# EAGLE design pico (EAGLE 6.4)
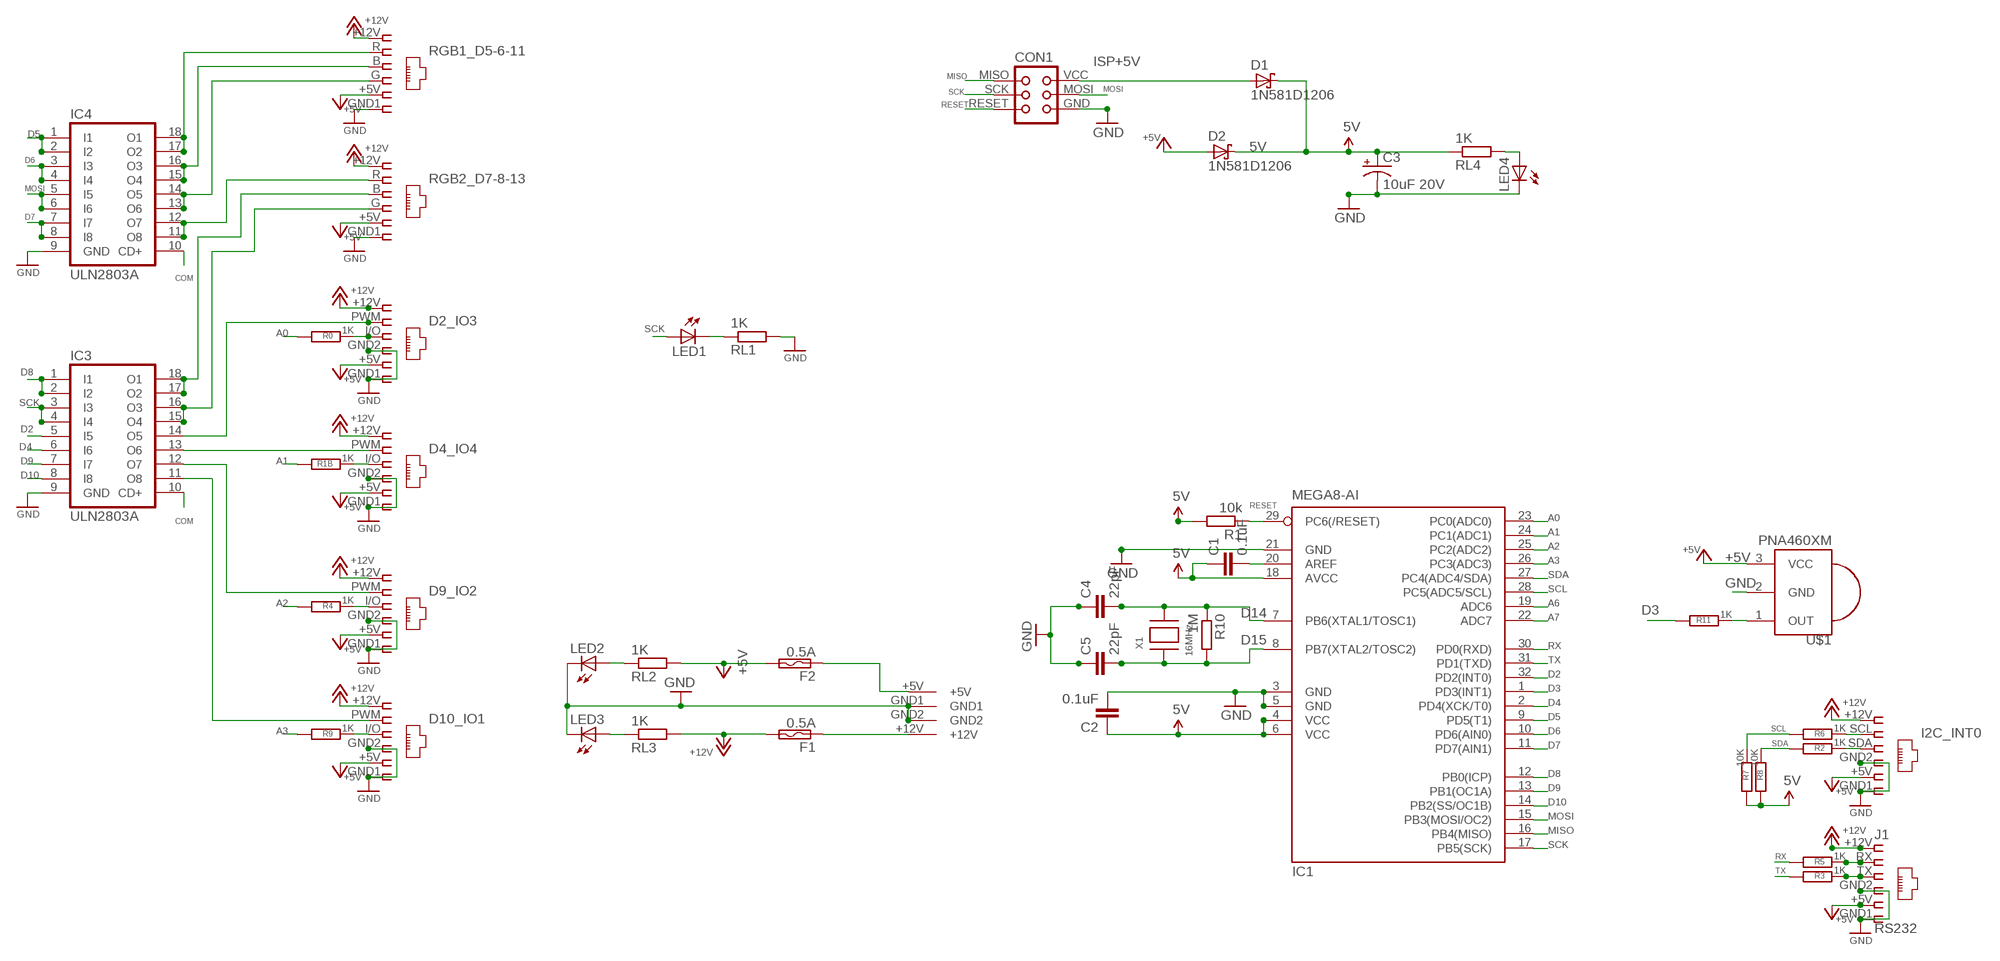
[diagram p0: schematic, sheet 1]

## Parts
C1  0.1uF  C-EUC1206  [C1206]
C2  0.1uF  C-EUC1206  [C1206]
C3  10uF 20V  CAP_POL1206-KIT  [EIA3216-KIT]
C4  22pF  C-EUC1206  [C1206]
C5  22pF  C-EUC1206  [C1206]
CON1  TINYISP  [TINYISP]
D1  1N581D1206  [LED-1206]
D2  1N581D1206  [LED-1206]
D2_IO3  IO3  RJ12STRAIGHT  [RJ12-STRAIGHT]
D4_IO4  IO4  RJ12STRAIGHT  [RJ12-STRAIGHT]
D9_IO2  IO2  RJ12STRAIGHT  [RJ12-STRAIGHT]
D10_IO1  IO1  RJ12STRAIGHT  [RJ12-STRAIGHT]
F1  0.5A  POLYSWITCHSMD1812  [C1812]
F2  0.5A  POLYSWITCHSMD1812  [C1812]
I2C_INT0  I2C  RJ12STRAIGHT-I2C  [RJ12-STRAIGHT-I2C]
IC1  MEGA8-AI  [TQFP32-08]
IC3  ULN2803A  [SO18W]
IC4  ULN2803A  [SO18W]
J1  RS232  RJ12STRAIGHT-RS232-SERVER  [RJ12-STRAIGHT-RS232]
LED1  LED3MM  [LED3MM]
LED2  LED3MM  [LED3MM]
LED3  LED3MM  [LED3MM]
LED4  LED3MM  [LED3MM]
R0  1K  R-EU_M1206  [M1206]
R1  10k  R-EU_M1206  [M1206]
R1B  1K  R-EU_M1206  [M1206]
R2  1K  R-EU_M1206  [M1206]
R3  1K  R-EU_M1206  [M1206]
R4  1K  R-EU_M1206  [M1206]
R5  1K  R-EU_M1206  [M1206]
R6  1K  R-EU_M1206  [M1206]
R7  10K  R-EU_M1206  [M1206]
R8  10K  R-EU_M1206  [M1206]
R9  1K  R-EU_M1206  [M1206]
R10  1M  R-EU_M1206  [M1206]
R11  1K  R-EU_M1206  [M1206]
RGB1_D5-6-11  RGB1  RJ12STRAIGHT-RGB  [RJ12-STRAIGHT-RGB]
RGB2_D7-8-13  RGB2  RJ12STRAIGHT-RGB  [RJ12-STRAIGHT-RGB]
RL1  1K  R-EU_M1206  [M1206]
RL2  1K  R-EU_M1206  [M1206]
RL3  1K  R-EU_M1206  [M1206]
RL4  1K  R-EU_M1206  [M1206]
U$1  PNA460XM  [PNA460XM]
U$2  KPJX-4S-S  [KPJX-4S-S]
X1  16MHz  XTALNX6035  [NX6035]

## Nets
5V [power]: C1.1 C2.1 C3.A(+) D1.C D2.C IC1.4(VCC) IC1.6(VCC) IC1.18(AVCC) R1.2 R7.2 R8.2 RL4.1
+5V: D2.A D2_IO3.+5V D4_IO4.+5V D9_IO2.+5V D10_IO1.+5V F2.2 I2C_INT0.+5V J1.+5V RGB1_D5-6-11.+5V RGB2_D7-8-13.+5V RL2.2 U$1.3(VCC)
+12V [highpower]: D2_IO3.+12V D4_IO4.+12V D9_IO2.+12V D10_IO1.+12V F1.2 I2C_INT0.+12V J1.+12V RGB1_D5-6-11.+12V RGB2_D7-8-13.+12V RL3.2
A0: IC1.23(PC0(ADC0)) R0.2
A1 [fine]: IC1.24(PC1(ADC1)) R1B.2
A2 [fine]: IC1.25(PC2(ADC2)) R4.2
A3 [fine]: IC1.26(PC3(ADC3)) R9.2
A6: IC1.19(ADC6)
A7: IC1.22(ADC7)
COM: IC3.10(CD+) IC4.10(CD+)
D2: IC1.32(PD2(INT0)) IC3.5(I5)
D2B: D9_IO2.I/O R4.1
D2B1: D10_IO1.I/O R9.1
D2B4: I2C_INT0.SDA R2.1
D2B5: J1.TX R3.1
D2B6: D2_IO3.I/O R0.1
D2B7: D4_IO4.I/O R1B.1
D3: IC1.1(PD3(INT1)) R11.2
D4: IC1.2(PD4(XCK/T0)) IC3.6(I6)
D5: IC1.9(PD5(T1)) IC4.1(I1) IC4.2(I2)
D6: IC1.10(PD6(AIN0)) IC4.3(I3) IC4.4(I4)
D7: IC1.11(PD7(AIN1)) IC4.7(I7) IC4.8(I8)
D8: IC1.12(PB0(ICP)) IC3.1(I1) IC3.2(I2)
D9: IC1.13(PB1(OC1A)) IC3.7(I7)
D10: IC1.14(PB2(SS/OC1B)) IC3.8(I8)
D14: C4.2 IC1.7(PB6(XTAL1/TOSC1)) R10.1 X1.P$2
D15: C5.2 IC1.8(PB7(XTAL2/TOSC2)) R10.2 X1.P$1
GND [power]: C2.2 C3.C(-) C4.1 C5.1 CON1.GND D2_IO3.GND1 D2_IO3.GND2 D4_IO4.GND1 D4_IO4.GND2 D9_IO2.GND1 D9_IO2.GND2 D10_IO1.GND1 D10_IO1.GND2 I2C_INT0.GND1 I2C_INT0.GND2 IC1.3(GND) IC1.5(GND) IC1.21(GND) IC3.9(GND) IC4.9(GND) J1.GND1 J1.GND2 LED2.K(C) LED3.K(C) LED4.K(C) RGB1_D5-6-11.GND1 RGB2_D7-8-13.GND1 RL1.2 U$1.2(GND) U$2.GND1 U$2.GND2
ISP+5V: CON1.VCC D1.A
MISO [fine]: CON1.MISO IC1.16(PB4(MISO))
MOSI [fine]: CON1.MOSI IC1.15(PB3(MOSI/OC2)) IC4.5(I5) IC4.6(I6)
N$1 [PWM]: IC4.13(O6) IC4.14(O5) RGB1_D5-6-11.G
N$2 [PWM]: D4_IO4.PWM IC3.13(O6)
N$3: LED1.K(C) RL1.1
N$4: C1.2 IC1.20(AREF)
N$5 [PWM]: IC4.11(O8) IC4.12(O7) RGB2_D7-8-13.R
N$6: F2.1 U$2.+5V
N$7: LED4.A RL4.2
N$8: F1.1 U$2.+12V
N$9: R11.1 U$1.1(OUT)
N$22 [PWM]: D9_IO2.PWM IC3.12(O7)
N$48 [PWM]: IC3.17(O2) IC3.18(O1) RGB2_D7-8-13.B
N$50 [PWM]: IC4.15(O4) IC4.16(O3) RGB1_D5-6-11.B
N$51 [PWM]: D10_IO1.PWM IC3.11(O8)
N$57 [PWM]: IC3.15(O4) IC3.16(O3) RGB2_D7-8-13.G
N$60 [PWM]: D2_IO3.PWM IC3.14(O5)
N$68 [PWM]: IC4.17(O2) IC4.18(O1) RGB1_D5-6-11.R
N$70: J1.RX R5.1
N$71: I2C_INT0.SCL R6.1
N$75: LED3.A RL3.1
N$76: LED2.A RL2.1
RESET [fine]: CON1.RESET IC1.29(PC6(/RESET)) R1.1
RX: IC1.30(PD0(RXD)) R5.2
SCK [fine]: CON1.SCK IC1.17(PB5(SCK)) IC3.3(I3) IC3.4(I4) LED1.A
SCL: IC1.28(PC5(ADC5/SCL)) R6.2 R7.1
SDA: IC1.27(PC4(ADC4/SDA)) R2.2 R8.1
TX: IC1.31(PD1(TXD)) R3.2

## Library data of the parts
C1 C2 C4 C5 = resistor:C-EU: CAPACITOR, European symbol
C3 = SparkFun:CAP_POL: Capacitor Polarized These are standard SMD and PTH capacitors. Normally 10uF, 47uF, and 100uF in electrolytic and tantalum varieties. Always verify the external diameter of the through hole cap, it varies with capacity, voltage, and manufacturer. The EIA devices should be standard.
CON1 = lpatiny:TINYISP: CONNECTOR; OC_FARNELL: unknown; OC_NEWARK: unknown
D1 D2 = lpatiny:1N581*: 1.0A SCHOTTKY BARRIER RECTIFIER Source: http://www.diodes.com/datasheets/ds23001.pdf
D2_IO3 D4_IO4 D9_IO2 D10_IO1 I2C_INT0 J1 RGB1_D5-6-11 RGB2_D7-8-13 = lpatiny:RJ12: CORCOM Modular RJ Jacks No Shield Source: www.tycoelectronics.com .. ENG_DS_1654001_1099_RJ_L_0507.pdf
F1 F2 = lpatiny:POLYSWITCH: PolySwitch (TM) Resettable Device Source: Data sheet <http://www.farnell.com/datasheets/13482.pdf>
IC1 = atmel:MEGA8: MICROCONTROLLER 8 Kbytes FLASH, 1 kbytes SRAM, 512 bytes EEPROM, USART, 6-channel 10 bit ADC, 2-channel 8 bit ADC Pin compatible with Atmega48, ATMega88, ATMega168 Source: avr.lbr; MPN: ATMEGA8-16AU; OC_FARNELL: 9171371; OC_NEWARK: 73M8863
IC3 IC4 = lpatiny:ULN2803A: DRIVER ARRAY
LED1-LED4 = lpatiny:LED3MM
R0 R1 R1B R2-R11 RL1-RL4 = resistor:R-EU_: RESISTOR, European symbol
U$1 = adafruit:PNA460XM: IR 38KHz receiver PNA4602 and related receivers http://www.ladyada.net/library/pcb/eaglelibrary.html
U$2 = lpatiny:KPJX-4S-S
X1 = lpatiny:XTAL: Low cost SMT crystals, no capacitors included http://www.ladyada.net/library/eagle

## Net classes
0 default: width 0.457 mm
1 power: width 0.457 mm
2 highpower: width 0.914 mm
3 fine: width 0.203 mm
4 PWM: width 0.61 mm

## Board
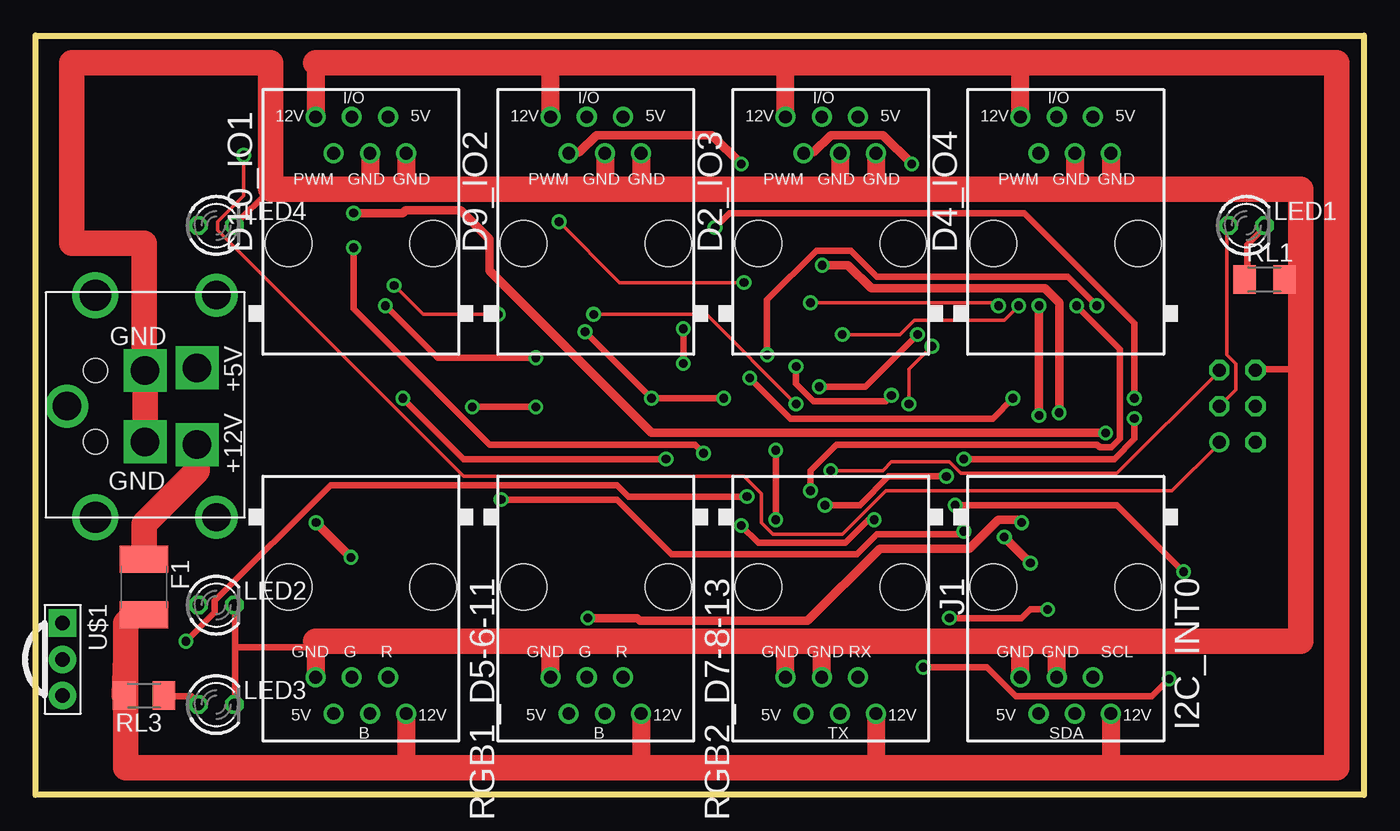
[diagram p1: board, top side]
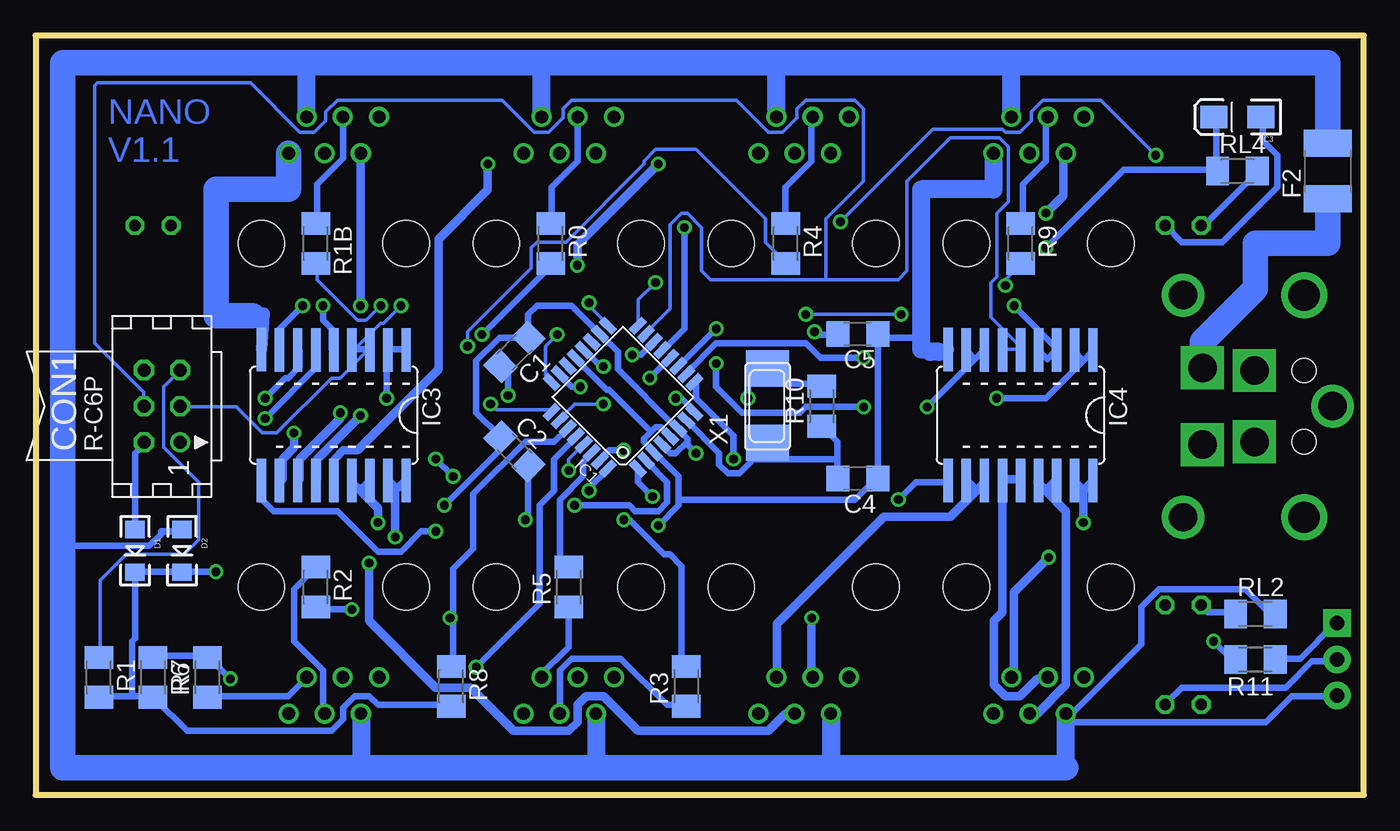
[diagram p2: board, bottom side, seen from below]

Size 93.34 x 53.34 mm. Coordinates in mm from the lower left corner, seen from the top.
Outline: 0,0 0,53.34 93.34,53.34 93.34,0 0,0
Copper layers (1*16): Top 0.035mm / dielectric 1.5mm / Bottom 0.035mm
Design rules "default *": minimum track width 10mil, minimum drill 24mil, track to track 8mil, track to pad 8mil, pad to pad 8mil, via to via 8mil, smd to smd 8mil, copper to edge 6mil, drill to drill 6mil, minimum pad ring 10mil, minimum via ring 8mil, stop-mask expansion 4mil, vias tented up to drill 0mil, thermal gap 10mil
vRestrict: area 17.8,19.7 to 30.5,24.8; area 17.8,28.6 to 30.5,33.7; area 66,28.6 to 78.7,33.7; area 66,19.7 to 78.7,24.8; area 44.4,26.6 to 53.4,35.6; area 50.8,20.3 to 59.7,29.3; area 50.8,26.6 to 59.7,35.6; area 44.4,20.3 to 53.4,29.3

### Footprints (pad centres in the part's own frame; a part is rotated, then mirrored left to right if it is on the bottom)
C1206 = smd 1.6 x 1.8: 1 -1.4,0; 2 1.4,0
EIA3216-KIT = smd 1.9 x 1.6: A 1.65,0; C -1.65,0
TINYISP = drill 0.914 octagon: GND 2.54,1.27; MOSI 0,1.27; RESET 2.54,-1.27; SCK 0,-1.27; VCC -2.54,1.27 | drill 0.914: MISO -2.54,-1.27
LED-1206 = smd 1.2 x 1.4: A -1.5,0; C 1.5,0
RJ12-STRAIGHT = drill 0.9 pad 1.4: +5V 1.905,8.89; +12V -3.175,8.89; GND1 3.175,6.35; GND2 0.635,6.35; I/O -0.635,8.89; PWM -1.905,6.35 | hole 3.251: -5.08,0; 5.08,0
C1812 = smd 1.9 x 3.4: 1 -1.95,0; 2 1.95,0
RJ12-STRAIGHT-I2C = drill 0.9 pad 1.4: +5V 1.905,8.89; +12V -3.175,8.89; GND1 3.175,6.35; GND2 0.635,6.35; SCL -1.905,6.35; SDA -0.635,8.89 | hole 3.251: -5.08,0; 5.08,0
TQFP32-08 = smd 1.27 x 0.559: 1 -4.293,2.8; 2 -4.293,2; 3 -4.293,1.2; 4 -4.293,0.4; 5 -4.293,-0.4; 6 -4.293,-1.2; 7 -4.293,-2; 8 -4.293,-2.8; 17 4.293,-2.8; 18 4.293,-2; 19 4.293,-1.2; 20 4.293,-0.4; 21 4.293,0.4; 22 4.293,1.2; 23 4.293,2; 24 4.293,2.8 | smd 0.559 x 1.27: 9 -2.8,-4.293; 10 -2,-4.293; 11 -1.2,-4.293; 12 -0.4,-4.293; 13 0.4,-4.293; 14 1.2,-4.293; 15 2,-4.293; 16 2.8,-4.293; 25 2.8,4.293; 26 2,4.293; 27 1.2,4.293; 28 0.4,4.293; 29 -0.4,4.293; 30 -1.2,4.293; 31 -2,4.293; 32 -2.8,4.293
SO18W = smd 0.66 x 3.048: 1 -5.08,-4.585; 2 -3.81,-4.585; 3 -2.54,-4.585; 4 -1.27,-4.585; 5 0,-4.585; 6 1.27,-4.585; 7 2.54,-4.585; 8 3.81,-4.585; 9 5.08,-4.623; 10 5.08,4.585; 11 3.81,4.585; 12 2.54,4.585; 13 1.27,4.585; 14 0,4.585; 15 -1.27,4.585; 16 -2.54,4.585; 17 -3.81,4.585; 18 -5.08,4.585
RJ12-STRAIGHT-RS232 = drill 0.9 pad 1.4: +5V 1.905,8.89; +12V -3.175,8.89; GND1 3.175,6.35; GND2 0.635,6.35; RX -1.905,6.35; TX -0.635,8.89 | hole 3.251: -5.08,0; 5.08,0
LED3MM = drill 0.813 octagon: A -1.27,0; K 1.27,0
M1206 = smd 1.6 x 2: 1 -1.4,0; 2 1.4,0
RJ12-STRAIGHT-RGB = drill 0.9 pad 1.4: +5V 1.905,8.89; +12V -3.175,8.89; B -0.635,8.89; G 0.635,6.35; GND1 3.175,6.35; R -1.905,6.35 | hole 3.251: -5.08,0; 5.08,0
PNA460XM = drill 1.016 pad 1.93 square: 1 -2.54,0 | drill 1.016 pad 1.93: 2 0,0; 3 2.54,0
KPJX-4S-S = drill 2 square: +5V 2.7,1.35; +12V -2.7,1.35; GND1 -2.5,5; GND2 2.5,5 | drill 2: P$1 -7.8,0; P$2 7.8,0; P$11 0,10.5 | drill 2.2: P$3 -7.8,8.5; P$4 7.8,8.5 | hole 1.7: -2.5,8.5; 2.5,8.5
NX6035 = smd 2.5 x 3: P$1 2.665,0; P$2 -2.565,0

### Placement (x,y rotation side)
C1  59.69,31.12 225 bottom
C2  59.69,24.13 315 bottom
C3  8.89,47.62 180 bottom
C4  35.56,22.23 180 bottom
C5  35.56,32.38 180 bottom
CON1  84.45,27.31 90 bottom
D1  86.36,17.15 270 bottom
D2  83.06,17.15 270 bottom
D2_IO3  55.88,38.73 0 top
D4_IO4  72.39,38.73 0 top
D9_IO2  39.37,38.73 0 top
D10_IO1  22.86,38.73 0 top
F1  7.62,14.61 270 top
F2  2.54,43.81 90 bottom
I2C_INT0  72.39,14.61 180 top
IC1  52.07,27.94 135 bottom
IC3  72.39,26.67 180 bottom
IC4  24.13,26.67 180 bottom
J1  55.88,14.61 180 top
LED1  85.09,40 0 top
LED2  12.7,13.33 0 top
LED3  12.7,6.35 0 top
LED4  12.7,40 0 top
R0  57.15,38.73 270 bottom
R1  88.9,8.26 270 bottom
R1B  73.66,38.73 270 bottom
R2  73.66,14.61 270 bottom
R3  47.62,7.62 90 bottom
R4  40.64,38.73 270 bottom
R5  55.88,14.61 90 bottom
R6  81.28,8.26 90 bottom
R7  85.09,8.26 270 bottom
R8  64.14,7.62 270 bottom
R9  24.13,38.73 270 bottom
R10  38.1,27.31 90 bottom
R11  7.62,9.53 180 bottom
RGB1_D5-6-11  22.86,14.61 180 top
RGB2_D7-8-13  39.37,14.61 180 top
RL1  86.36,36.2 0 top
RL2  7.62,12.7 0 bottom
RL3  7.62,6.98 180 top
RL4  8.89,43.81 0 bottom
U$1  1.91,9.53 270 top
U$2  12.7,27.31 90 top
X1  41.91,27.31 90 bottom

### Tracks (layer width: path | path; a pad name or v marks a point on that pad's centre or on a via)
5V  (via drill 0.61)
  Top 0.457: v22.35,38.43 22.35,34.16 31.9,24.61 46.33,24.61 v46.94,24 | v80.67,15.67 76,20.35 v64.62,20.35
  Bottom 0.457: 58.93,32.13 C1.1 | R8.2 64.21,6.33 69.29,6.33 69.9,6.93 70.92,6.93 71.73,6.12 71.73,5.31 72.54,4.5 82.7,4.5 84.94,6.73 R7.2 85.14,6.93 86.56,6.93 | 86.56,6.93 88.8,6.93 R1.2 | 86.56,6.93 86.56,10.79 86.36,11 D1.C 86.36,15.67 83.11,15.67 D2.C 82.91,15.67 v80.67,15.67 | C1.1 59.13,32.13 60.76,32.13 62.38,30.51 62.38,26.85 60.76,25.22 C2.1 60.76,25.02 60.76,24.21 v64.62,20.35 | C3.A 10.36,47.57 10.36,43.92 RL4.1 10.57,43.92 16.87,43.92 v22.35,38.43 | 47.55,24.82 47.55,25.02 48.16,25.63 IC1.6 48.36,25.83 52.43,29.9 52.43,31.12 53.65,32.33 IC1.18 53.85,32.54 55.68,34.37 58.12,34.37 58.73,33.76 58.73,32.33 C1.1 | 47.55,24.82 48.36,24 48.77,24 49.38,24.61 IC1.4 | v46.94,24 47.55,24.61 47.55,24.82
+5V
  Bottom 0.457: D2.A 83.11,18.52 84.53,18.52 84.53,18.31 85.34,17.5 91.44,17.5 | 2.03,6.93 U$1.3 2.23,6.93 5.08,6.93 6.91,5.1 20.95,5.1 | RL2.2 6.3,12.83 6.71,12.83 8.33,14.45 14.43,14.45 15.65,13.23 15.65,10.59 20.52,5.71 RGB1_D5-6-11.+5V
  Bottom 1.27: 20.95,1.91 20.95,5.1 RGB1_D5-6-11.+5V | RGB2_D7-8-13.+5V 37.47,1.91 | J1.+5V 53.98,1.91 | I2C_INT0.+5V 70.48,1.91 | D4_IO4.+5V 74.3,51.43 | D2_IO3.+5V 57.78,51.43 | D9_IO2.+5V 41.27,51.43 | D10_IO1.+5V 24.77,51.43
  Bottom 1.778: 20.95,1.91 37.47,1.91 53.98,1.91 70.48,1.91 91.44,1.91 91.44,17.5 91.44,51.43 74.3,51.43 57.78,51.43 41.27,51.43 24.77,51.43 2.54,51.43 F2.2
+12V
  Top 1.27: 19.68,51.43 D10_IO1.+12V | D9_IO2.+12V 36.2,51.43 | RGB1_D5-6-11.+12V 26.04,1.91 | RGB2_D7-8-13.+12V 42.55,1.91 | J1.+12V 59.05,1.91 | I2C_INT0.+12V 75.56,1.91 | D4_IO4.+12V 69.22,51.43 | D2_IO3.+12V 52.7,51.43
  Top 1.778: 19.68,51.43 36.2,51.43 52.7,51.43 69.22,51.43 91.44,51.43 91.44,1.91 75.56,1.91 59.05,1.91 42.55,1.91 26.04,1.91 6.35,1.91 6.35,9.39 RL3.2 6.35,9.65 6.35,12.06 6.94,12.65 F1.2
A0  (via drill 0.61)
  Top 0.457: v55.07,28.68 58.32,28.68 v61.98,32.33
  Bottom 0.457: v55.07,28.68 55.68,28.68 56.49,29.49 IC1.23 | v61.98,32.33 57.1,37.21 R0.2
A1  (via drill 0.61)
  Top 0.254: v56.69,32.33 60.76,32.33 61.77,33.35 68.07,33.35 v69.09,34.37
  Bottom 0.254: v56.69,32.33 57.51,31.52 57.51,29.49 57.1,29.08 IC1.24 | v69.09,34.37 70.1,33.35 70.71,33.35 73.56,36.2 73.56,37.21 R1B.2
A2  (via drill 0.61)
  Top 0.254: v61.37,27.46 61.37,29.9 v62.99,31.52
  Bottom 0.254: v61.37,27.46 60.96,27.05 57.1,27.05 IC1.25 | v62.99,31.52 62.99,32.54 58.52,37.01 58.52,38.43 58.12,38.84 56.08,38.84 50.6,44.32 50.6,44.53 49.78,45.34 46.94,45.34 42.06,40.46 42.06,38.84 40.64,37.41 R4.2
A3  (via drill 0.61)
  Top 0.254: v53.44,27.46 47.14,33.76 v39.22,33.76 | v32.51,33.76 27.23,33.76 v25.2,35.79
  Bottom 0.254: v53.44,27.46 55.47,27.46 56.49,26.44 IC1.26 | v32.51,33.76 v39.22,33.76 | v25.2,35.79 25.2,36.2 24.18,37.21 R9.2
COM  (via drill 0.61)
  Top 0.457: v32.72,20.75 40.84,20.75 44.7,16.89 57.71,16.89 59.13,18.31 65.02,18.31 v65.23,18.52
  Bottom 0.457: v32.72,20.75 31.5,21.97 29.26,21.97 IC4.10 | v65.23,18.52 66.24,18.52 67.67,17.09 69.29,17.09 72.14,19.94 76.61,19.94 77.42,20.75 77.42,21.97 IC3.10
D2  (via drill 0.61)
  Top 0.457: v54.46,21.36 54.46,22.78 56.29,24.61 74.57,24.61 74.78,24.41 75.59,24.41 76.2,25.02 76.2,31.32 v73.15,34.37
  Bottom 0.457: v54.46,21.36 54.46,21.57 53.24,22.78 IC1.32 | v73.15,34.37 73.15,33.35 72.54,32.74 72.54,31.32 IC3.5
D2B
  Bottom 0.457: R4.1 40.64,42.7 38.81,44.53 38.81,47.57 D9_IO2.I/O
D2B1
  Bottom 0.457: R9.1 23.98,40.26 23.98,42.9 22.35,44.53 22.35,47.57 D10_IO1.I/O
D2B4
  Bottom 0.457: R2.1 73.76,15.88 75.18,14.45 75.18,10.79 73.15,8.76 73.15,5.71 I2C_INT0.SDA
D2B5
  Bottom 0.457: R3.1 47.75,6.33 48.97,6.33 52.22,9.58 55.68,9.58 56.49,8.76 56.49,5.71 J1.TX
D2B6
  Bottom 0.457: R0.1 57.1,40.26 57.1,42.7 55.27,44.53 55.27,47.57 D2_IO3.I/O
D2B7
  Bottom 0.457: 73.56,40.26 R1B.1 73.56,40.46 73.56,42.9 71.73,44.73 71.73,47.57 D4_IO4.I/O
D3  (via drill 0.61)
  Top 0.457: v49.99,20.96 41.66,20.96 40.84,21.77 20.73,21.77 12.6,13.64 12.6,12.83 v10.57,10.79
  Bottom 0.457: v49.99,20.96 51,21.97 51,22.78 IC1.1 | v10.57,10.79 9.14,9.37 R11.2
D4  (via drill 0.61)
  Top 0.457: v55.47,20.35 57.91,20.35 59.94,22.38 v64.01,22.38 | v65.23,23.6 75.79,23.6 77.22,25.02 v77.22,26.44
  Bottom 0.457: 73.56,31.12 IC3.6 73.56,30.91 73.56,30.1 v77.22,26.44 | v55.47,20.35 51.61,20.35 51.21,19.94 49.58,19.94 48.97,20.55 48.97,21.97 50.39,23.39 IC1.2 | v65.23,23.6 v64.01,22.38
D5  (via drill 0.61)
  Top 0.457: v44.3,23.6 30.07,23.6 v25.81,27.86
  Bottom 0.457: v44.3,23.6 44.3,25.22 46.94,27.86 46.94,28.88 IC1.9 | v25.81,27.86 22.35,27.86 19.71,30.51 | 19.71,30.51 19.1,31.12 IC4.1 | 19.71,30.51 20.32,31.12 IC4.2
D6  (via drill 0.61)
  Top 0.457: v35.15,30.71 28.25,30.71 v24.59,34.37
  Bottom 0.457: IC4.4 22.76,31.12 22.25,30.61 21.74,31.12 IC4.3 21.54,31.32 v24.59,34.37 | v35.15,30.71 38.2,30.71 39.22,31.73 45.52,31.73 47.55,29.69 IC1.10
D7  (via drill 0.61)
  Top 0.457: v45.52,30.3 v45.52,32.74 | v30.68,27.25 v35.15,27.25
  Bottom 0.457: 26.82,31.32 IC4.7 26.82,31.12 27.33,30.61 | 27.84,31.32 IC4.8 27.84,31.12 27.33,30.61 | v45.52,32.74 48.16,30.1 IC1.11 | v45.52,30.3 45.52,28.68 43.69,26.85 39.62,26.85 39.22,27.25 v35.15,27.25 | 27.33,30.61 v30.68,27.25
D8  (via drill 0.61)
  Top 0.457: v50.19,29.29 53.03,26.44 67.26,26.44 v68.68,27.86
  Bottom 0.457: v50.19,29.29 48.77,30.71 IC1.12 | v68.68,27.86 68.68,31.12 IC3.2 68.48,31.32 67.46,31.32 IC3.1
D9  (via drill 0.61)
  Top 0.457: v47.75,39.85 48.77,40.87 69.49,40.87 77.22,33.15 v77.22,27.86
  Bottom 0.457: 74.78,31.12 IC3.7 74.78,30.91 74.78,30.1 75.59,29.29 75.79,29.29 v77.22,27.86 | v47.75,39.85 47.75,32.74 49.17,31.32 IC1.13
D10  (via drill 0.61)
  Top 0.457: v51.41,30.91 51.41,34.77 54.86,38.23 57.3,38.23 59.13,36.4 72.54,36.4 v74.57,34.37
  Bottom 0.457: v51.41,30.91 50.8,30.91 49.99,31.73 IC1.14 | v74.57,34.37 76.2,32.74 IC3.8
D14
  Bottom 0.457: 36.98,23.6 36.98,24.82 38,25.83 R10.1 | 36.98,23.6 36.98,22.38 C4.2 | IC1.7 47.55,26.24 45.31,24 45.31,23.19 44.7,22.58 43.89,22.58 41.86,24.61 X1.P$2 42.67,23.6 36.98,23.6
D15  (via drill 0.61)
  Top 0.457: v48.36,27.86 v43.28,27.86 v38.61,32.54
  Bottom 0.457: 36.98,32.33 C5.2 37.19,32.33 38.41,32.33 v38.61,32.54 | v48.36,27.86 47.95,27.86 47.14,27.05 IC1.8 | v43.28,27.86 43.28,28.68 42.06,29.9 X1.P$1 42.88,28.88 38.2,28.88 R10.2
GND  (via drill 0.61)
  Top 0.457: 14.02,6.53 LED3.K 14.02,6.73 14.02,10.39 | RL1.2 88.9,36.2 | 71.73,8.36 I2C_INT0.GND2 | 19.68,10.79 18.9,10.39 14.02,10.39 | 14.02,10.39 14.02,13.23 LED2.K | v58.93,19.33 58.52,19.33 56.9,17.7 50.8,17.7 v49.58,18.92 | D2_IO3.GND2 56.49,45.14 56.52,44.93 | 88.9,29.9 85.75,29.9 CON1.GND | 16.51,42.54 LED4.K
  Top 1.27: U$2.GND2 7.62,29.81 | 19.68,10.79 RGB1_D5-6-11.GND1 | RGB2_D7-8-13.GND1 36.2,10.79 | J1.GND1 52.7,10.79 | I2C_INT0.GND1 69.22,10.79 | J1.GND2 55.24,10.79 | D4_IO4.GND1 75.56,42.54 | D2_IO3.GND1 59.05,42.54 | D9_IO2.GND1 42.55,42.54 | D10_IO1.GND1 26.04,42.54 | 71.73,8.36 71.75,8.36 71.75,10.79 | D4_IO4.GND2 73.03,42.54 | 56.49,44.93 56.52,44.93 56.52,42.54 | D10_IO1.GND2 23.5,42.54 | D9_IO2.GND2 40.01,42.54
  Top 1.778: U$2.GND1 U$2.GND2 | 7.62,29.81 7.62,38.73 2.54,38.73 2.54,51.43 16.51,51.43 16.51,42.54 23.5,42.54 26.04,42.54 40.01,42.54 42.55,42.54 56.52,42.54 59.05,42.54 73.03,42.54 75.56,42.54 88.9,42.54 88.9,36.2 88.9,29.9 88.9,10.79 71.75,10.79 69.22,10.79 55.24,10.79 52.7,10.79 36.2,10.79 19.68,10.79
  Bottom 0.457: 34.14,32.33 C5.1 | 33.93,32.13 C5.1 | 55.47,30.71 IC1.21 55.27,30.51 53.24,28.47 53.03,28.47 50.09,25.53 | 26.04,44.45 26.21,44.93 D10_IO1.GND1 | U$1.2 2.03,9.37 3.66,9.37 5.49,7.54 12.8,7.54 13.82,6.53 LED3.K | 50.09,25.53 50.6,25.02 50.6,24.82 49.99,24.21 IC1.3 49.78,24 48.16,22.38 48.16,20.75 | 50.09,25.53 49.78,25.83 49.38,25.83 48.77,25.22 IC1.5 | v58.93,19.33 58.73,19.53 58.73,22.99 C2.2 | v49.58,18.92 48.16,20.35 48.16,20.75 | LED4.K 12.8,38.84 9.96,38.84 6.1,42.7 6.1,44.93 7.11,45.95 7.11,47.57 C3.C | C5.1 34.14,32.13 34.14,22.38 C4.1 34.34,22.17 35.76,20.75 48.16,20.75 | 31.11,32.13 33.73,32.13 C5.1
  Bottom 0.813: IC4.9 31.11,31.29 29.84,31.12 | IC3.9 77.29,33.83 78.11,33.66
  Bottom 1.27: 29.84,31.12 30.48,31.12 | 26.04,44.45 26.04,42.54 31.11,42.54 31.11,32.13 31.11,31.29
  Bottom 1.778: 78.11,33.66 80.64,33.66 80.64,42.54 75.56,42.54 D4_IO4.GND1
ISP+5V
  Bottom 0.457: D1.A 86.36,24 85.75,24.61 CON1.VCC
MISO  (via drill 0.61)
  Top 0.254: v49.78,35.99 41.05,35.99 v36.78,40.26 | v14.63,44.93 14.63,42.09 12.8,40.26 12.8,39.65 30.07,22.38 49.78,22.38 51,21.16 51,19.13 51.82,18.31 56.69,18.31 59.74,21.36 79.86,21.36 83.11,24.61 CON1.MISO
  Bottom 0.254: v49.78,35.99 51,34.77 51,33.15 IC1.16 | v36.78,40.26 30.28,46.76 25.4,46.76 25.2,46.56 24.18,46.56 23.37,47.37 23.37,47.98 22.55,48.79 18.49,48.79 v14.63,44.93
MOSI
  Bottom 0.254: 37.8,36.2 32.72,36.2 32.11,36.8 32.11,43.1 29.06,46.15 25.6,46.15 24.99,45.54 24.99,41.68 25.81,40.87 25.81,36.4 26.21,35.99 26.21,33.55 24.18,31.52 IC4.5 24.38,31.32 25.2,31.32 | 37.8,36.2 45.92,36.2 46.53,36.8 46.53,39.85 47.55,40.87 47.95,40.87 48.77,40.06 48.77,34.16 50.39,32.54 IC1.15 | 37.8,36.2 37.8,40.46 35.15,43.1 35.15,48.18 35.76,48.79 39.22,48.79 39.83,48.18 39.83,47.57 40.84,46.56 41.86,46.56 44.09,48.79 55.68,48.79 56.29,48.18 56.29,47.57 57.3,46.56 58.32,46.56 60.55,48.79 72.14,48.79 72.95,47.98 72.95,47.37 73.76,46.56 74.78,46.56 78.23,50.01 89,50.01 89.2,49.81 89.2,31.73 85.75,28.27 85.75,27.46 CON1.MOSI
  Bottom 0.457: 24.18,31.32 IC4.5 | 25.2,31.32 IC4.6
N$1
  Bottom 0.61: RGB1_D5-6-11.G 22.35,8.15 22.96,8.15 24.18,6.93 25.2,6.93 26.01,7.75 26.01,12.22 25.4,12.83 IC4.13 25.2,22.17 24.18,22.17 IC4.14
N$2  (via drill 0.61)
  Top 0.61: v70.51,26.65 v70.51,34.37
  Bottom 0.61: v70.51,34.37 70.51,44.93 D4_IO4.PWM | v70.51,26.65 73.56,23.6 73.56,22.17 IC3.13
N$3
  Top 0.457: RL1.1 85.14,36.2 85.14,38.63 86.36,39.85 LED1.K
N$4  (via drill 0.61)
  Top 0.457: v53.44,30.1 53.44,28.88 54.66,27.66 59.74,27.66 v60.15,28.07
  Bottom 0.457: v53.44,30.1 53.65,30.1 54.66,31.12 IC1.20 | v60.15,28.07 60.15,29.69 60.55,30.1 C1.2
N$5
  Bottom 0.61: 27.23,21.36 26.62,21.97 IC4.12 | 27.23,21.36 29.06,19.53 33.73,19.53 41.25,12.01 41.25,8.36 RGB2_D7-8-13.R | 27.23,21.36 27.84,21.97 IC4.11
N$6
  Bottom 0.457: 11.38,31.12 11.35,31.75 11.35,31.83
  Bottom 1.778: 11.35,31.83 7.62,35.56 7.62,38.73 2.54,38.73 F2.1 | U$2.+5V 11.35,31.75
N$7
  Bottom 0.457: RL4.2 7.52,43.71 11.38,39.85 LED4.A
N$8
  Top 1.778: U$2.+12V 11.35,22.78 7.62,19.05 F1.1
N$9
  Bottom 0.457: R11.1 6.1,9.58 4.47,9.58 2.03,12.01 U$1.1
N$22  (via drill 0.61)
  Top 0.61: v49.58,44.32 47.55,46.35 39.42,46.35 38.2,45.14 37.59,45.14 D9_IO2.PWM | v55.27,37.21 57.1,37.21 58.73,35.59 70.92,35.59 71.93,34.57 v71.93,26.85
  Bottom 0.61: v49.58,44.32 55.27,38.63 v55.27,37.21 | v71.93,26.85 71.93,26.44 74.78,23.6 74.78,22.17 IC3.12
N$48  (via drill 0.61)
  Top 0.61: v68.07,18.11 v69.9,16.28
  Bottom 0.61: RGB2_D7-8-13.B 40.64,5.71 41.86,4.5 51,4.5 53.44,6.93 54.66,6.93 55.27,6.33 55.27,5.1 55.88,4.5 59.74,4.5 62.79,7.54 65.23,7.54 69.9,12.22 v69.9,16.28 | 68.07,21.57 v68.07,18.11 | 68.07,21.57 68.48,21.97 IC3.17 | IC3.18 67.46,21.97 67.87,21.57 68.07,21.57
N$50
  Bottom 0.61: RGB1_D5-6-11.B 22.96,5.71 20.93,7.75 20.93,19.94 22.35,21.36 | 22.35,21.36 22.96,21.97 IC4.15 | 22.35,21.36 21.74,21.97 IC4.16
N$51  (via drill 0.61)
  Top 0.61: v22.35,40.87 25.81,40.87 26.01,41.07 29.87,41.07 31.9,39.04 31.9,36.8 43.28,25.43 v75.18,25.43
  Bottom 0.457: IC3.11 76.2,20.75
  Bottom 0.61: v22.35,40.87 21.13,42.09 21.13,44.93 D10_IO1.PWM | v75.18,25.43 75.18,24.41 76,23.6 76,22.17 IC3.11
N$57  (via drill 0.61)
  Top 0.61: v38.81,12.42 42.27,12.42 42.47,12.22 54.25,12.22 59.33,17.3 65.63,17.3 67.67,19.33 69.09,19.33 v69.29,19.13
  Bottom 0.61: v38.81,12.42 38.81,8.36 RGB2_D7-8-13.G | v69.29,19.13 69.29,20.14 70.51,21.36 | 70.51,21.36 71.12,21.97 IC3.15 | 70.51,21.36 69.9,21.97 IC3.16
N$60  (via drill 0.61)
  Top 0.61: v61.57,44.32 59.54,46.35 55.88,46.35 54.66,45.14 54.05,45.14 D2_IO3.PWM
  Bottom 0.61: v61.57,44.32 61.57,42.49 65.02,39.04 65.02,29.9 70.71,24.21 71.73,24.21 72.34,23.6 72.34,22.17 IC3.14
N$68  (via drill 0.61)
  Top 0.61: v19.71,19.13 v22.15,16.69
  Bottom 0.61: v22.15,16.69 24.59,14.25 24.59,8.36 RGB1_D5-6-11.R | 19.71,21.36 v19.71,19.13 | 19.71,21.36 19.1,21.97 IC4.18 | 19.71,21.36 20.32,21.97 IC4.17
N$70
  Bottom 0.457: R5.1 55.88,10.39 57.91,8.36 J1.RX
N$71
  Bottom 0.457: R6.1 81.28,6.93 75.59,6.93 74.37,8.15 I2C_INT0.SCL
N$75
  Top 0.457: 9.14,6.93 RL3.1 9.35,6.93 10.97,6.93 11.38,6.53 LED3.A
N$76
  Bottom 0.457: RL2.1 9.14,12.83 10.97,12.83 11.38,13.23 LED2.A
RESET  (via drill 0.61)
  Top 0.254: v55.88,22.78 59.54,22.78 60.15,23.39 64.21,23.39 65.02,22.58 76,22.58 83.11,29.69 CON1.RESET
  Bottom 0.254: v55.88,22.78 55.88,23.6 54.86,24.61 IC1.29 | R1.1 88.8,9.78 88.8,15.06 86.97,16.89 82.91,16.89 81.89,17.91 81.89,21.97 84.33,24.41 84.33,28.68 83.31,29.69 CON1.RESET
RX
  Bottom 0.457: IC1.30 54.25,24 54.86,23.39 54.86,22.38 56.49,20.75 56.49,16.69 55.88,16.08 R5.2
SCK  (via drill 0.61)
  Top 0.254: LED1.A 83.72,39.85 83.72,30.91 84.33,30.3 84.33,28.47 83.31,27.46 CON1.SCK | v54.46,34.57 67.46,34.57 v67.67,34.37
  Bottom 0.254: v54.46,34.57 54.46,34.37 53.24,33.15 IC1.17 | v67.67,34.37 68.89,33.15 69.09,33.15 70.71,31.52 70.71,31.32 | CON1.SCK 83.11,27.25 79.25,27.25 77.42,25.43 76.4,25.43 72.54,29.29 71.93,29.29 70.1,31.12 IC3.3
  Bottom 0.457: IC3.4 71.12,31.32 70.71,31.32 69.9,31.32 IC3.3
SCL  (via drill 0.61)
  Top 0.457: v62.38,8.97 66.85,8.97 68.89,6.93 78.44,6.93 v79.65,8.15
  Bottom 0.457: R7.1 84.73,9.78 81.28,9.78 R6.2 81.08,9.58 v79.65,8.15 | v62.38,8.97 57.91,13.44 57.91,20.35 56.9,21.36 56.9,23.6 55.47,25.02 IC1.28
SDA  (via drill 0.61)
  Top 0.457: v71.12,13.03 69.9,13.03 69.29,12.42 v64.21,12.42
  Bottom 0.457: 64.01,12.42 64.01,9.17 R8.1 | 64.01,12.42 64.01,15.88 62.59,17.3 62.59,21.16 58.93,24.82 56.9,24.82 56.08,25.63 IC1.27 | v71.12,13.03 73.56,13.03 R2.2 | v64.21,12.42 64.01,12.42
TX  (via drill 0.61)
  Top 0.457: v52.02,19.33 v52.02,24.21
  Bottom 0.457: 47.95,9.37 47.75,9.17 R3.2 47.95,9.58 47.95,16.08 48.77,16.89 49.17,16.89 51.61,19.33 v52.02,19.33 | v52.02,24.21 53.03,24.21 53.65,23.6 IC1.31

### Text on the board
Bottom: NANO / V1.1